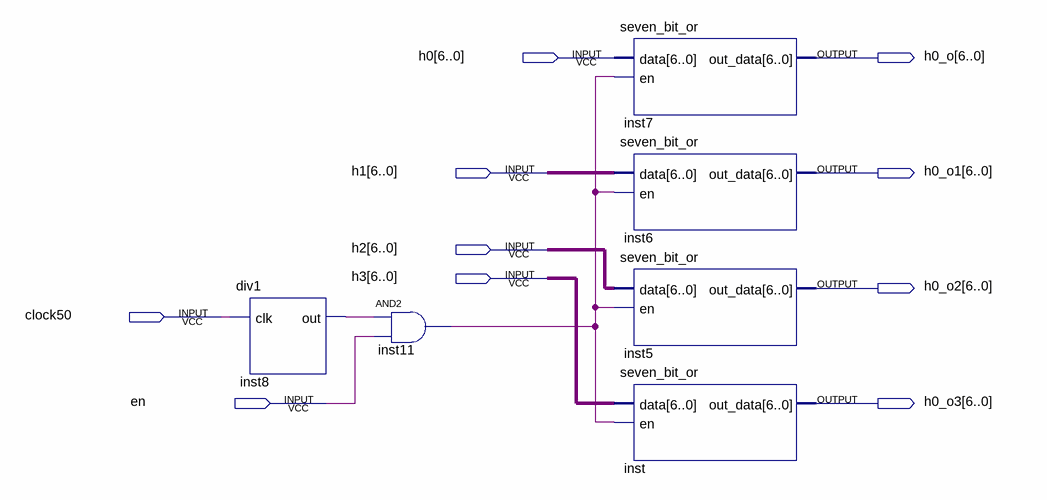
[diagram p0: schematic sheet]
// Quartus schematic seven_display_blink.bdf as structural Verilog: 6 symbols, 10 pins
module seven_display_blink (
  input  [6:0] h0,
  input  [6:0] h1,
  input  [6:0] h2,
  input  [6:0] h3,
  input  clock50,
  input  en,
  output [6:0] h0_o,
  output [6:0] h0_o1,
  output [6:0] h0_o2,
  output [6:0] h0_o3
);

  wire inst8_out, inst11_out;

  div1 inst8 (.clk(clock50), .out(inst8_out));
  and inst11 (inst11_out, inst8_out, en);
  seven_bit_or inst7 (.data(h0), .en(inst11_out), .out_data(h0_o));
  seven_bit_or inst6 (.data(h1), .en(inst11_out), .out_data(h0_o1));
  seven_bit_or inst5 (.data(h2), .en(inst11_out), .out_data(h0_o2));
  seven_bit_or inst (.data(h3), .en(inst11_out), .out_data(h0_o3));
endmodule
